# EAGLE schematic colalightslk-proto (EAGLE 6.2)
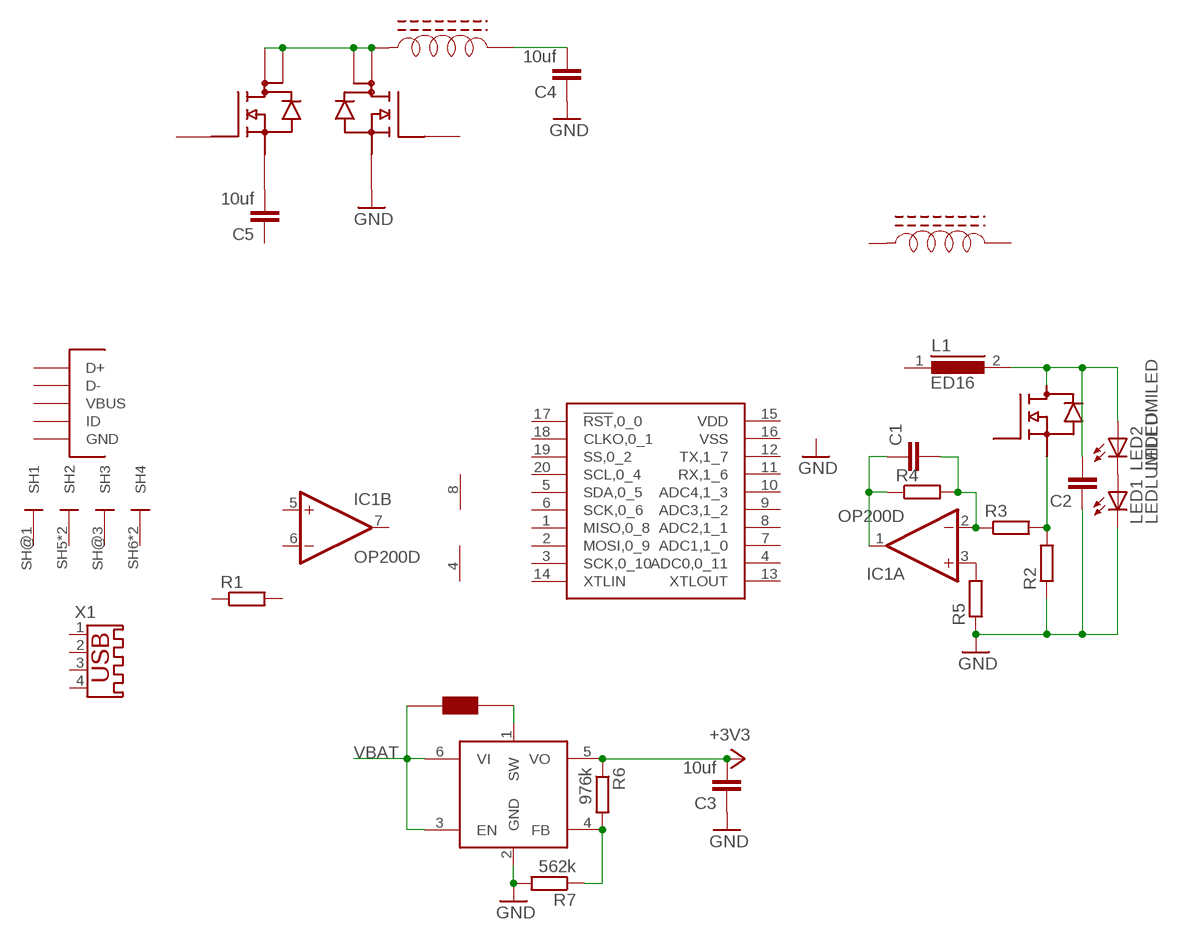
[diagram p0: schematic, sheet 1]

## Parts
C1  C-EUC0805  [C0805]
C2  C-EUC0805  [C0805]
C3  10uf  C-EUC0805  [C0805]
C4  10uf  C-EUC0805  [C0805]
C5  10uf  C-EUC0805  [C0805]
IC1  OP200D  [SO08]
L1  ED16  [ED16]
LED1  LEDLUMILED  [LUMILED]
LED2  LEDLUMILED  [LUMILED]
R1  R-EU_R1210  [R1210]
R2  R-EU_R1210  [R1210]
R3  R-EU_R0805  [R0805]
R4  R-EU_R0805  [R0805]
R5  R-EU_R0805  [R0805]
R6  976k  R-EU_R0805  [R0805]
R7  562k  R-EU_R0805  [R0805]
U$1  LPC111XFD20  [TSSOP-20]
U$2  FCI-MICROUSB-B-PEG  [MICROUSB-B-PEG]
U$3  NTD4963N  [IPAK]
U$4  MCP1623/4  [SOT23-6]
U$5  4.7uH  CBC2016T2R2M  [TAIYO-YUDEN-2016]
U$6  NTMD4820NR2G  [SOIC-8-NARROW]
U$8  NRS6028  [NRS60XX]
U$9  NRS6028  [NRS60XX]
X1  USB-A003  [USB-A003]

## Nets
+3V3: C3.2 R6.1 U$4.5(VO)
GND: C2.1 C3.1 C4.1 LED1.4-(C) R2.1 R5.1 R7.2 U$4.2(GND) U$6.3(S2)
N$1: LED1.2+(A) LED2.4-(C)
N$2: C2.2 L1.2 LED2.2+(A) U$3.P$2(D)
N$3: R2.2 R3.2 U$3.P$3(S)
N$4: IC1.3(A:+IN) R5.2
N$5: R6.2 R7.1 U$4.4(FB)
N$6: C1.2 IC1.2(A:-IN) R3.1 R4.2
N$7: C1.1 IC1.1(A:OUT) R4.1
N$9: C4.2 U$9.P$2(L2)
N$10: U$4.1(SW) U$5.P$2
N$11: C5.2 U$6.1(S1)
N$12: U$6.5(DP2) U$6.6(D2) U$6.7(DP1) U$6.8(D1) U$9.P$1(L1)
VBAT: U$4.3(EN) U$4.6(VI) U$5.P$1
Unconnected: C5.1 IC1.5(B:+IN) IC1.6(B:-IN) IC1.7(B:OUT) L1.1 R1.1 R1.2 U$1.1(MISO,0_8) U$1.2(MOSI,0_9) U$1.3(SCK,0_10) U$1.4(ADC0,0_11) U$1.5(SDA,0_5) U$1.6(SCK,0_6) U$1.7(ADC1,1_0) U$1.8(ADC2,1_1) U$1.9(ADC3,1_2) U$1.10(ADC4,1_3) U$1.11(RX,1_6) U$1.12(TX,1_7) U$1.13(XTLOUT) U$1.14(XTLIN) U$1.15(VDD) U$1.16(VSS) U$1.17(!RST,0_0) U$1.18(CLKO,0_1) U$1.19(SS,0_2) U$1.20(SCL,0_4) U$2.P$1(VBUS) U$2.P$2(D-) U$2.P$3(D+) U$2.P$4(ID) U$2.P$5(GND) U$2.SH5(SH2) U$2.SH6(SH4) U$2.SH@1(SH1) U$2.SH@2(SH2) U$2.SH@3(SH3) U$2.SH@4(SH4) U$3.P$1(G) U$6.2(G1) U$6.4(G2) U$8.P$1(L1) U$8.P$2(L2) X1.1 X1.2 X1.3 X1.4

## Power pins joined to a net without a drawn wire
V+: IC1.8(P:V+)
V-: IC1.4(P:V-)

## Library data of the parts
C1-C5 = rcl:C-EU: CAPACITOR, European symbol
IC1 = linear:OP200: OP AMP
L1 = inductors:ED16: INDUCTOR
LED1 LED2 = led-lumiled:LED: LED - LUMILED® LXK2-PW12-R00, LXK2-PW12-S00, LXK2-PW14-U00, LXK2-PW14-V00 LXK2-PM12-R00, LXK2-PM12-S00, LXK2-PM14-U00 LXK2-PE12-Q00, LXK2-PE12-R00, LXK2-PE12-S00, LXK2-PE14-T00, LXK2-PE14-U00 LXK2-PB12-K00, LXK2-PB12-L00, LXK2-PB12-M00, LXK2-PB14-N00, LXK2-PB14-P00, LXK2-PB14-Q00 LXK2-PR12-L00, LXK2-PR12-M00, LXK2-PR14-Q00, LXK2-PR14-R00 LXK2-PD12-Q00, LXK2-PD12-R00, LXK2-PD12-S00 LXK2-PH12-R00, LXK2-PH12-S00 LXK2-PL12-P00, LXK2-PL12-Q00, LXK2-PL12-R00 Source: www.luxeon.com; OC_FARNELL: unknown; OC_NEWARK: unknown
R1-R7 = rcl:R-EU_: RESISTOR, European symbol
U$1 = amino:LPC111XFD20
U$2 = amino:FCI-MICROUSB-B-PEG
U$3 = amino:NTD4963N
U$4 = amino:MCP1623/4
U$5 = amino:CBC2016T2R2M
U$6 = amino:NTMD4820NR2G
U$8 U$9 = amino:NRS6028
X1 = con-yamaichi:USB-A003: USB connector; OC_FARNELL: unknown; OC_NEWARK: unknown